# EasyEDA Pro project ProPrj_SuperCapTestBoard - 2.1_2024-07-26.epro, board PCB2
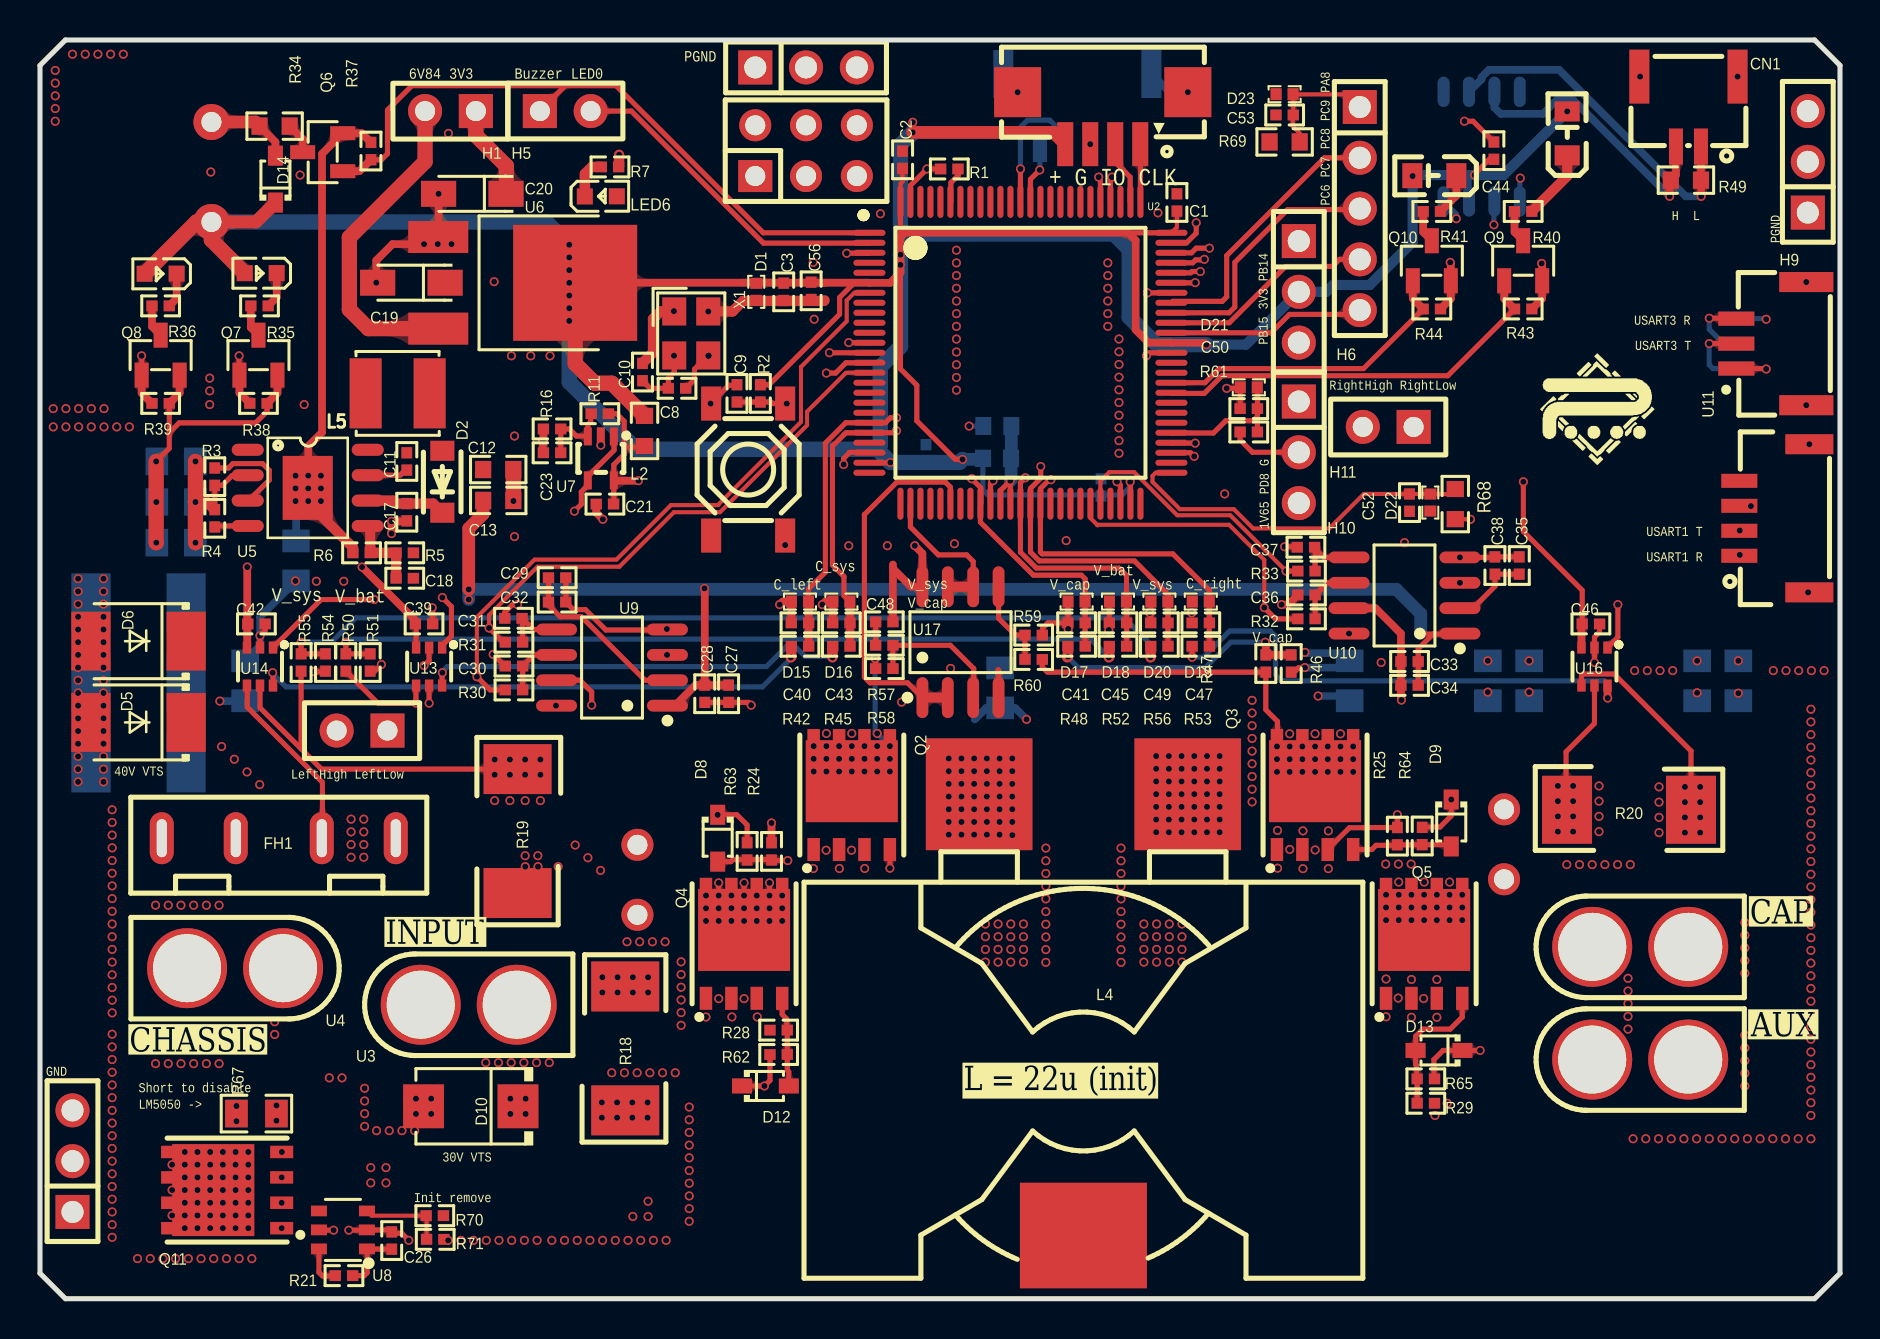
[diagram p3: board, top side]
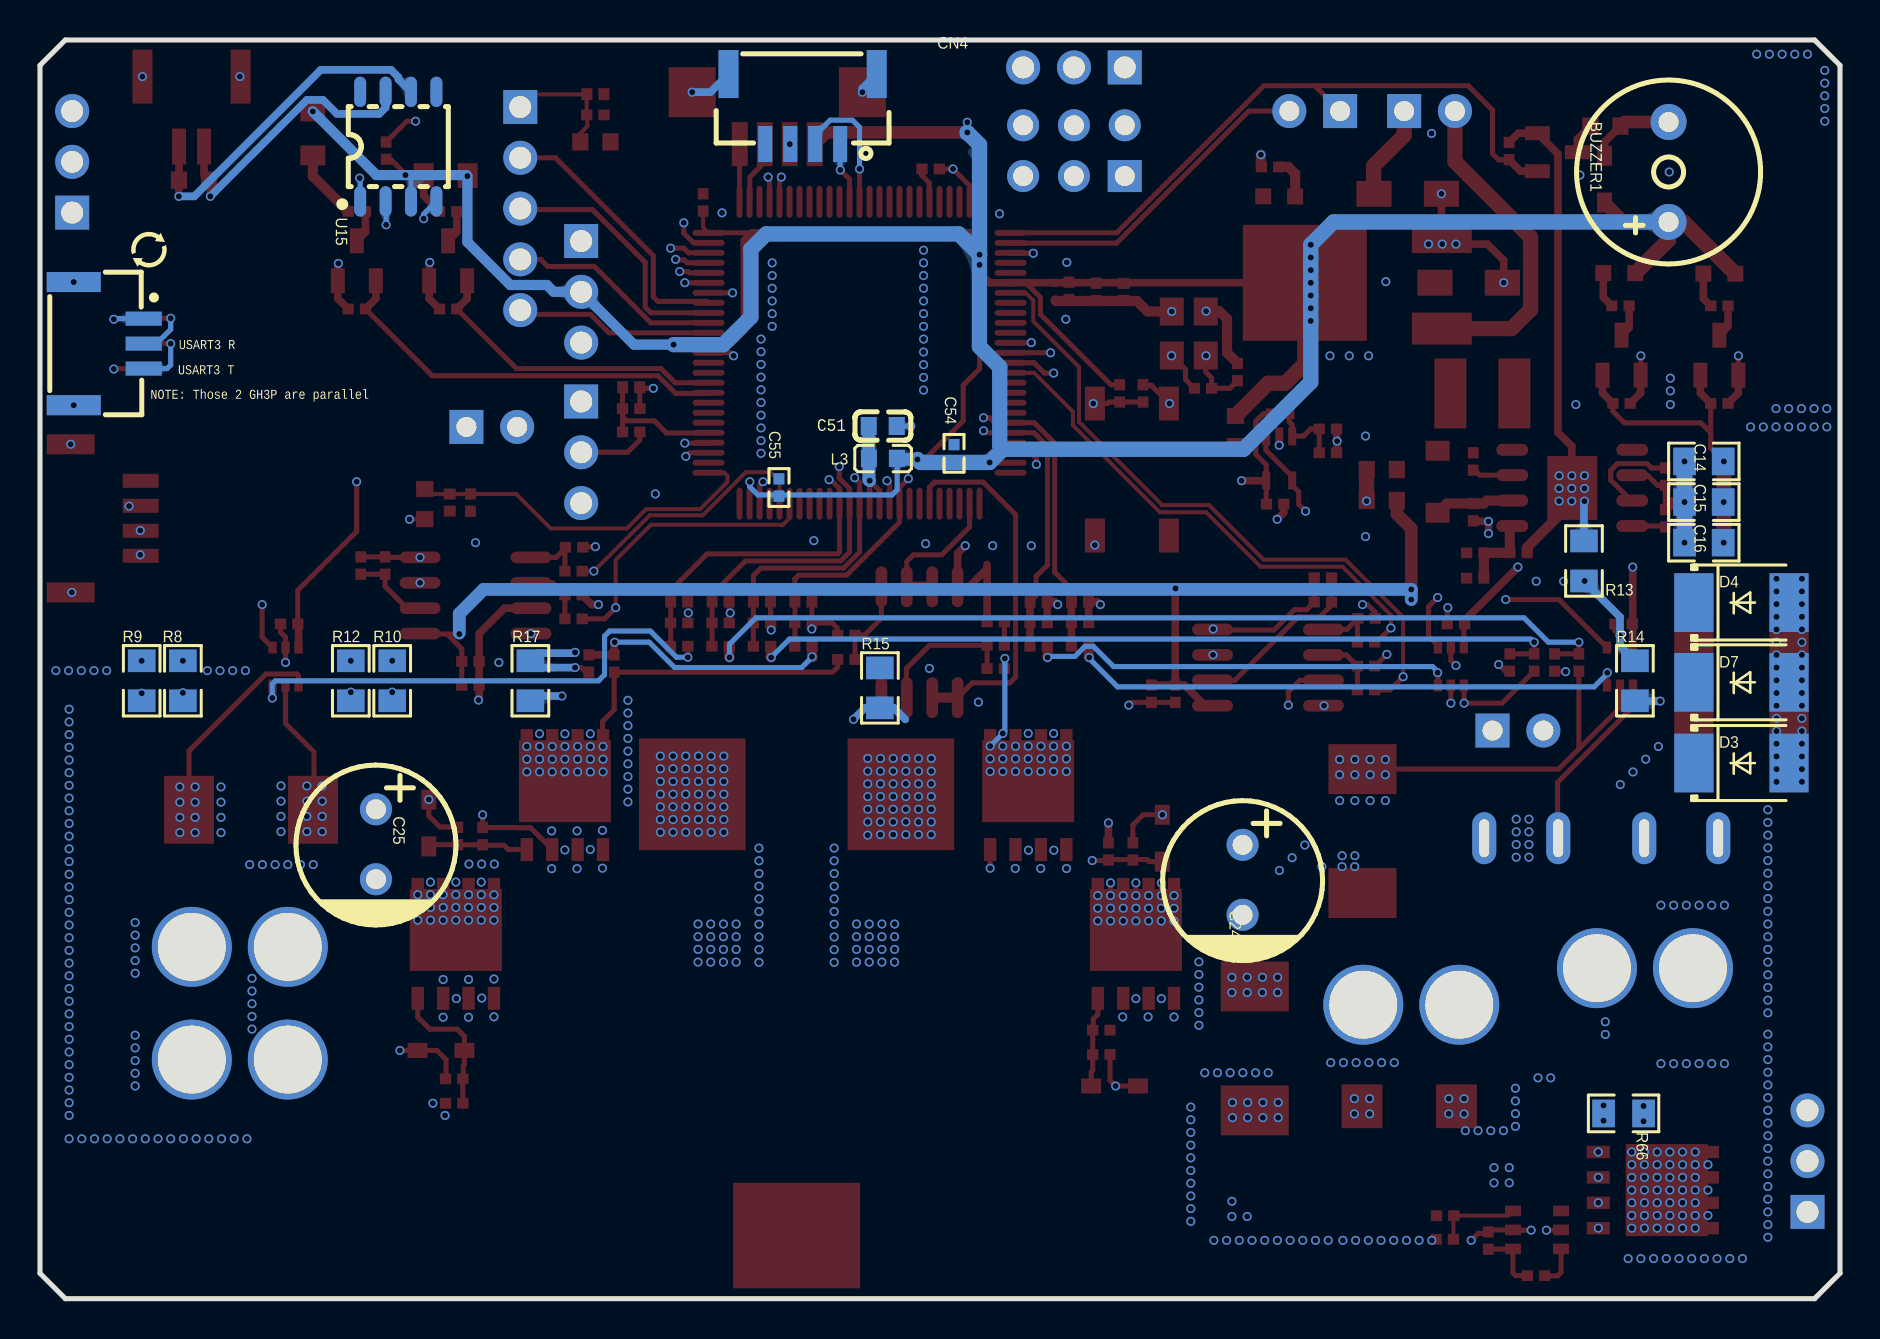
[diagram p4: board, bottom side, seen from below]

Outline 90 x 62.96 mm; copper layers: Top Layer, Inner1, Inner2, Bottom Layer. Coordinates in mm from the lower left corner of the outline.
Outline path: 0,61.69 0,1.27 1.27,0 88.73,0 90,1.27 90,61.69 88.73,62.96 1.27,62.96 0,61.69
Stack: Top Layer 0.035mm 外层铜厚1oz / Dielectric1 0.2104mm 7628 RC49% 8.6mil / Inner1 0.0152mm 内层铜厚 / Dielectric2 1.065mm 1.1mm H/HOZ 含铜 / Inner2 0.0152mm 内层铜厚 / Dielectric3 0.2104mm 7628 RC49% 8.6mil / Bottom Layer 0.035mm 外层铜厚1oz

## Design rules (mm)
template: 自定义配置
spacing copperThickness1oz (default): track to track 0.102, other pairs 0.152 to 0.3
spacing copperThickness2oz: track to track 0.203, other pairs 0.152 to 0.3
spacing copperThicknessInner0.5oz: track to track 0.089, other pairs 0.152 to 0.3
track width copperThickness1oz (default): min 0.102, default 0.254, max 155.001
track width copperThickness2oz: min 0.203, default 0.254, max 2.54
track width copperThickness0.5oz: min 0.089, default 0.254, max 2.54
differential pair differentialPair (default): width min 0.127, default 0.254, max 2.54; gap min 0.152, default 0.152
via viaSize (default): diameter min 0.3, default 0.61, max 10; hole min 0.201, default 0.305, max 6.299
pour e43426 uses copperRegion1

## Placement (name value [footprint] x y rotation side)
BUZZER1  3kHz  [BUZ-TH_BD9.0-P5.00-D0.6-FD]  8.57 56.36 90 bottom
C1  100nF  [C0402]  56.84 54.84 270 top
C2  100nF  [C0402]  43.13 56.97 270 top
C3  4.7uF  [C0402]  37.19 50.37 90 top
C8  22pF  [C0402]  31.85 45.54 0 top
C9  1uF  [C0402]  34.85 45.29 270 top
C10  22pF  [C0402]  30.12 46.35 270 top
C11  100nF  [C0402]  18.34 41.88 90 top
C12  10uF  [C0603]  22.91 41.48 180 top
C13  10uF  [C0603]  22.91 39.93 180 top
C14  1uF  [R0805_NEW]  6.81 41.88 0 bottom
C15  1uF  [R0805_NEW]  6.81 39.85 0 bottom
C16  1uF  [R0805_NEW]  6.81 37.82 0 bottom
C17  100nF  [C0402]  18.34 39.34 90 top
C18  100pF  [C0402]  18.24 36.04 0 top
C19  10uF  [CAP-SMD_L3.2-W1.6-RD-C7171]  18.57 50.82 180 top
C20  10uF  [CAP-SMD_L3.2-W1.6-RD-C7171]  21.62 55.27 180 top
C21  1uF  [C0402]  28.25 39.75 180 top
C23  1uF  [C0402]  25.6 42.31 180 top
C24  100uF  [CAP-TH_BD8.0-P3.50-D0.6-FD]  29.87 20.95 270 bottom
C25  100uF  [CAP-TH_BD8.0-P3.50-D0.6-FD]  73.2 22.73 270 bottom
C26  100nF  [C0402]  17.59 2.91 270 top
C27  10nF  [C0402]  34.43 30.26 90 top
C28  1uF  [C0402]  33.24 30.26 90 top
C29  100nF  [C0402]  25.86 36.07 180 top
C30  1nF  [C0402]  23.7 31.65 180 top
C31  1nF  [C0402]  23.67 34.03 180 top
C32  1nF  [C0402]  25.86 34.85 180 top
C33  10nF  [C0402]  68.48 31.87 0 top
C34  1uF  [C0402]  68.48 30.68 0 top
C35  100nF  [C0402]  73.97 36.68 270 top
C36  1nF  [C0402]  63.32 35.2 180 top
C37  1nF  [C0402]  63.3 37.59 180 top
C38  1nF  [C0402]  72.75 36.68 270 top
C39  100nF  [C0402]  19.2 33.75 0 top
C40  1nF  [C0402]  38 33.81 0 top
C41  1nF  [C0402]  51.83 33.81 0 top
C42  100nF  [C0402]  10.82 33.75 0 top
C43  1nF  [C0402]  40.07 33.81 0 top
C44  100nF  [C0402]  72.69 57.43 90 top
C45  1nF  [C0402]  53.9 33.81 0 top
C46  100nF  [C0402]  77.54 33.75 0 top
C47  1nF  [C0402]  58.04 33.81 0 top
C48  100nF  [C0402]  42.22 33.86 180 top
C49  1nF  [C0402]  55.97 33.81 0 top
C50  1nF  [C0402]  60.44 44.52 0 top
C51  1uF  [C0603#2]  47.86 43.66 0 bottom
C52  1nF  [C0402]  68.48 39.82 90 top
C53  1nF  [C0402]  62.23 59.21 0 top
C54  100nF  [C0402]  44.3 42.29 270 bottom
C55  100nF  [C0402]  53.05 40.58 270 bottom
C56  100nF  [C0402]  38.56 50.42 90 top
CN1  HC-GH-2PWT  [CONN-SMD_2P-P1.25_HCTL_HC-GH-2PWTKK]  82.42 59.38 180 top
CN2  SWD  [CONN-SMD_4P-P1.25-HC-1.25-4PWT]  53.14 59.05 180 top
CN3  USART1  [CONN-SMD_HC-GH-4PWT]  86.72 39.04 90 top
CN4  USART2 Rote  [CONN-SMD_HC-GH-4PWT]  51.87 59.51 0 bottom
D1  ESD9B3.3ST5G-N  [DFN1006-2L-BI]  35.81 50.37 90 top
D2  SM4007PL  [SOD-123F_L2.8-W1.8-LS3.7-RD]  20.12 40.87 90 top
D3  SMBJ40A  [SMB_L4.3-W3.6-LS5.4-R-RD]  4.93 26.79 180 bottom
D4  SMBJ40A  [SMB_L4.3-W3.6-LS5.4-R-RD]  4.93 34.82 180 bottom
D5  SMBJ40A  [SMB_L4.3-W3.6-LS5.4-R-RD]  4.93 28.83 180 top
D6  SMBJ40A  [SMB_L4.3-W3.6-LS5.4-R-RD]  4.93 32.89 180 top
D7  SMBJ40A  [SMB_L4.3-W3.6-LS5.4-R-RD]  4.93 30.83 180 bottom
D8  1N4148WS  [SOD-323_L1.8-W1.3-LS2.5-RD]  33.88 23.04 270 top
D9  1N4148WS  [SOD-323_L1.8-W1.3-LS2.5-RD]  70.56 23.8 270 top
D10  SMBJ30A  [SMB_L4.6-W3.6-LS5.3-RD]  21.54 9.62 180 top
D12  1N4148WS  [SOD-323_L1.8-W1.3-LS2.5-RD]  36.27 10.64 0 top
D13  1N4148WS  [SOD-323_L1.8-W1.3-LS2.5-RD]  69.95 12.42 180 top
D14  1N4148WS  [SOD-323_L1.8-W1.3-LS2.5-RD]  11.77 56.01 90 top
D15  ESD9B3.3ST5G-N  [DFN1006-2L-BI]  38 34.87 0 top
D16  ESD9B3.3ST5G-N  [DFN1006-2L-BI]  40.07 34.87 0 top
D17  ESD9B3.3ST5G-N  [DFN1006-2L-BI]  51.83 34.87 0 top
D18  ESD9B3.3ST5G-N  [DFN1006-2L-BI]  53.9 34.87 0 top
D19  ESD9B3.3ST5G-N  [DFN1006-2L-BI]  58.04 34.87 0 top
D20  ESD9B3.3ST5G-N  [DFN1006-2L-BI]  55.97 34.87 0 top
D21  ESD9B3.3ST5G-N  [DFN1006-2L-BI]  60.44 45.59 0 top
D22  ESD9B3.3ST5G-N  [DFN1006-2L-BI]  69.51 39.82 90 top
D23  ESD9B3.3ST5G-N  [DFN1006-2L-BI]  62.23 60.25 0 top
FH1  XF-506P  [FUSE-TH_XF-506P]  11.94 23.04 0 top
H1  AnalogVoltage  [HDR-TH_2P-P2.54-V-F]  20.52 59.41 180 top
H5  PWM test  [HDR-TH_2P-P2.54-V-F]  26.26 59.41 0 top
H6  -  [HDR-TH_5P-P2.54-V-M]  65.99 54.53 270 top
H7  Switch  [HDR-TH_3P-P2.54-V-M]  62.94 50.37 270 top
H8  -  [HDR-TH_2P-P2.54-V-F]  16.1 28.42 180 top
H9  -  [HDR-TH_3P-P2.54-V-M]  88.39 56.87 90 top
H10  ADC test  [HDR-TH_3P-P2.54-V-M]  62.94 42.34 270 top
H11  -  [HDR-TH_2P-P2.54-V-F]  67.41 43.61 180 top
H12  -  [HDR-TH_3P-P2.54-V-M]  1.63 6.88 90 top
H13  -  [HDR-TH_6P-P2.54-V-F-R2-C3-S2.54]  38.3 57.43 0 top
H14  -  [HDR-TH_3P-P2.54-V-M]  38.3 61.59 0 top
L2  GZ1608D601TF  [R0603_NEW]  30.23 43.41 270 top
L3  GZ1608D601TF  [L0603]  47.85 42.03 0 bottom
L4  22uH  [IND-SMD_3P-L27.9-W19.7-P10.43-LS27.9-BL-A]  52.17 14.2 180 top
L5  22uH  [IND-SMD_L4.0-W4.0]  17.88 45.29 0 top
LED2  RLED0  [LED0603-RD_WHITE]  11.04 51.3 180 top
LED3  YLED1  [LED0603-RD_WHITE]  6.03 51.27 180 top
LED4  LED B0  [LED0805-RD_BLUE]  76.36 58.29 90 top
LED5  LED B1  [LED0805-RD_BLUE]  69.72 56.18 180 top
LED6  KT-0603R  [LED0603-RD_WHITE]  28.04 55.14 0 top
Q2  STL130N6F7  [POWERFLAT-8_L5.2-W6.0-P1.27-LS6.2-BL]  40.59 25.19 0 top
Q3  STL130N6F7  [POWERFLAT-8_L5.2-W6.0-P1.27-LS6.2-BL]  63.75 25.19 0 top
Q4  STL130N6F7  [POWERFLAT-8_L5.2-W6.0-P1.27-LS6.2-BL]  35.2 17.75 0 top
Q5  STL130N6F7  [POWERFLAT-8_L5.2-W6.0-P1.27-LS6.2-BL]  69.21 17.75 0 top
Q6  2N7002  [SOT-23-3_L2.9-W1.3-P1.90-LS2.4-BR]  14.13 57.35 0 top
Q7  2N7002  [SOT-23-3_L2.9-W1.3-P1.90-LS2.4-BR]  10.92 47.2 270 top
Q8  2N7002  [SOT-23-3_L2.9-W1.3-P1.90-LS2.4-BR]  6.03 47.2 270 top
Q9  2N7002  [SOT-23-3_L2.9-W1.3-P1.90-LS2.4-BR]  74.16 51.92 270 top
Q10  2N7002  [SOT-23-3_L2.9-W1.3-P1.90-LS2.4-BR]  69.59 51.92 270 top
Q11  STL130N6F7  [POWERFLAT-8_L5.2-W6.0-P1.27-LS6.2-BL]  9.36 5.43 90 top
R1  10kΩ  [R0402]  45.47 56.51 0 top
R2  10kΩ  [R0402]  36.02 45.29 90 top
R3  470Ω  [R0402]  8.74 41.12 270 top
R4  1MΩ  [R0402]  8.74 39.04 90 top
R5  4.7kΩ  [R0402]  18.24 37.31 180 top
R6  1kΩ  [R0402]  16.08 37.31 0 top
R7  1kΩ  [R0402]  28.5 56.61 0 top
R8  0Ω  [R0805]  82.85 30.91 270 bottom
R9  0Ω  [R0805]  84.92 30.91 270 bottom
R10  0Ω  [R0805]  72.39 30.91 270 bottom
R11  4.7kΩ  [R0402]  27.99 44.27 180 top
R12  0Ω  [R0805]  74.46 30.91 90 bottom
R13  0Ω  [R0805]  12.8 36.9 90 bottom
R14  0Ω  [R0805]  10.25 30.91 90 bottom
R15  0Ω  [R0805]  48.01 30.55 90 bottom
R16  4.7kΩ  [R0402]  25.6 43.51 180 top
R17  0Ω  [R0805]  65.48 30.91 90 bottom
R18  5mΩ  [RES-SMD_L6.4-W3.2-1]  29.26 12.52 270 top
R19  5mΩ  [RES-SMD_L6.4-W3.2-1]  23.88 23.39 90 top
R20  5mΩ  [RES-SMD_L6.4-W3.2-1]  79.45 24.46 180 top
R21  100Ω  [R0402]  15.2 1.15 180 top
R24  10kΩ  [R0402]  36.58 22.38 270 top
R25  10kΩ  [R0402]  67.87 23.14 270 top
R28  10kΩ  [R0402]  36.93 13.43 0 top
R29  10kΩ  [R0402]  69.29 9.78 180 top
R30  100Ω  [R0402]  23.7 30.45 0 top
R31  100Ω  [R0402]  23.7 32.84 0 top
R32  100Ω  [R0402]  63.32 34.01 0 top
R33  100Ω  [R0402]  63.32 36.4 0 top
R34  330Ω  [R0603]  11.73 58.66 180 top
R35  1kΩ  [R0402]  10.97 49.66 0 top
R36  1kΩ  [R0402]  6.03 49.66 0 top
R37  10kΩ  [R0402]  16.55 57.41 270 top
R38  10kΩ  [R0402]  10.92 44.79 180 top
R39  10kΩ  [R0402]  6.03 44.79 180 top
R40  200Ω  [R0402]  74.16 54.39 0 top
R41  200Ω  [R0402]  69.59 54.39 0 top
R42  33Ω  [R0402]  38 32.64 0 top
R43  10kΩ  [R0402]  74.16 49.51 180 top
R44  10kΩ  [R0402]  69.59 49.51 180 top
R45  33Ω  [R0402]  40.07 32.64 0 top
R46  1kΩ  [R0402]  62.56 31.77 90 top
R47  10kΩ  [R0402]  61.29 31.77 270 top
R48  33Ω  [R0402]  51.83 32.64 0 top
R49  120Ω  [R0603]  82.3 55.95 180 top
R50  10kΩ  [R0402]  15.29 31.82 270 top
R51  1kΩ  [R0402]  16.51 31.82 90 top
R52  33Ω  [R0402]  53.9 32.64 0 top
R53  33Ω  [R0402]  58.04 32.64 0 top
R54  1kΩ  [R0402]  14.28 31.82 90 top
R55  10kΩ  [R0402]  13.06 31.82 270 top
R56  33Ω  [R0402]  55.97 32.64 0 top
R57  1kΩ  [R0402]  42.22 32.69 0 top
R58  10kΩ  [R0402]  42.22 31.52 180 top
R59  1kΩ  [R0402]  49.68 33.2 180 top
R60  10kΩ  [R0402]  49.68 31.98 0 top
R61  33Ω  [R0402]  60.44 43.36 0 top
R62  2Ω  [R0402]  36.93 12.22 0 top
R63  2Ω  [R0402]  35.36 22.38 270 top
R64  2Ω  [R0402]  69.11 23.14 90 top
R65  2Ω  [R0402]  69.29 11 0 top
R66  0Ω  [R0805]  10.82 9.27 0 bottom
R67  0Ω  [R0805]  10.82 9.26 0 top
R68  0Ω  [R0603]  70.76 39.75 90 top
R69  0Ω  [R0603]  62.23 57.87 0 top
R70  100kΩ  [R0402]  19.74 4.15 180 top
R71  100kΩ  [R0402]  19.76 2.97 180 top
SW1  Reset  [SW-SMD_4P-L5.1-W5.1-P3.70-LS6.5-TL-2]  35.41 41.48 270 top
U1  Capacitor  [CONN-TH_XT30U-F]  80.01 11.96 180 top
U2  STM32G473VET6  [LQFP-100_L14.0-W14.0-P0.50-LS16.0-BL]  49.02 47.32 270 top
U3  P_input  [CONN-TH_XT30U-F]  21.44 14.7 180 top
U4  Chassis  [CONN-TH_XT30U-F]  9.75 16.53 0 top
U5  SY8501FCC  [SO-8_L4.9-W3.9-P1.27-LS6.0-BL-EP]  13.39 40.56 270 top
U6  LM1117DTX-3.3/NOPB  [TO-252-2_L6.6-W6.1-P4.57-LS9.9-BR-CW]  23.33 50.82 180 top
U7  TLV521DCKR  [SC-70-5_L2.1-W1.3-P0.65-LS2.1-BR]  28.04 42.03 90 top
U8  LM5050MK-1/NOPB  [TSOT-23-6_L2.9-W1.6-P0.95-LS2.8-BR]  15.15 3.44 0 top
U9  UCC27284QDRQ1  [SOIC-8_L4.9-W3.9-P1.27-LS6.0-BL]  28.6 31.57 90 top
U10  UCC27284QDRQ1  [SOIC-8_L4.9-W3.9-P1.27-LS6.0-BL]  68.22 35.18 90 top
U11  USART3  [CONN-SMD_GH-3PWT]  86.57 47.78 90 top
U12  USART3 Rote  [CONN-SMD_GH-3PWT]  86.56 47.78 270 bottom
U13  C_sys  [SC-70-6_L2.2-W1.3-P0.65-LS2.1-BR]  19.46 31.62 90 top
U14  C_left  [SC-70-6_L2.2-W1.3-P0.65-LS2.1-BR]  11 31.62 90 top
U15  SN65HVD232D  [SOIC-8_L4.9-W3.9-P1.27-LS6.0-TL]  72.09 57.63 90 bottom
U16  C_right  [SC-70-6_L2.2-W1.3-P0.65-LS2.1-BR]  77.72 31.62 90 top
U17  OPAMPtest  [SOIC-8_L4.9-W3.9-P1.27-LS6.0-BL]  46.03 32.84 0 top
U18  Chassis_P  [CONN-TH_XT30U-F]  80.01 17.6 180 top
X1  48MHz  [CRYSTAL-SMD_4P-L3.2-W2.5-BL]  32.56 48.28 270 top

## Footprints (pads in the part's own frame, mm; a bottom-side part is the same pattern mirrored in y, then rotated)
BUZ-TH_BD9.0-P5.00-D0.6-FD
  round 1.8 hole 1: 1(-2.5,0) 2(2.5,0)
C0402
  rect 0.566x0.54 smd: 1(-0.433,0) 2(0.433,0)
C0603
  rect 0.806x0.864 smd: 1(-0.753,0) 2(0.753,0)
C0603#2
  rect 0.8x0.9 smd: 1(-0.7,0) 2(0.7,0)
CAP-SMD_L3.2-W1.6-RD-C7171
  rect 1.758x1.296 smd: 1(-1.687,0) 2(1.687,0)
CAP-TH_BD8.0-P3.50-D0.6-FD
  round 1.6 hole 1: 1(-1.75,0) 2(1.75,0)
CONN-SMD_2P-P1.25_HCTL_HC-GH-2PWTKK
  rect 0.7x1.8 smd: 1(-0.625,1.75) 2(0.625,1.75)
  rect 1x2.7 smd: 3(2.455,-1.75) 4(-2.455,-1.75)
CONN-SMD_4P-P1.25-HC-1.25-4PWT
  rect 0.8x2.2 smd: 1(-1.875,1.3) 2(-0.625,1.3) 3(0.625,1.3) 4(1.875,1.3)
  rect 2.35x2.5 smd: 5(4.255,-1.3) 6(-4.255,-1.3)
CONN-SMD_GH-3PWT
  rect 0.7x1.8 smd: 1(-1.25,1.75) 2(0,1.75) 3(1.25,1.75)
  rect 1x2.7 smd: 4(-3.08,-1.75) 5(3.08,-1.75)
CONN-SMD_HC-GH-4PWT
  rect 0.7x1.8 smd: 1(-1.875,1.75) 2(-0.625,1.75) 3(0.625,1.75) 4(1.875,1.75)
  rect 1x2.4 smd: 5(3.705,-1.75) 6(-3.705,-1.75)
CONN-TH_XT30U-F
  round 4 hole 3.4: 1(2.4,0) 2(-2.4,0)
CRYSTAL-SMD_4P-L3.2-W2.5-BL
  rect 1.4x1.2 smd: 1(-1.1,-0.85) 2(1.1,-0.85) 3(1.1,0.85) 4(-1.1,0.85)
DFN1006-2L-BI
  rect 0.55x0.6 smd: 1(-0.425,0) 2(0.425,0)
FUSE-TH_XF-506P
  oval 1.2x2.6 hole 0.5x1.9: 1(-5.85,0) 1(-2.15,0) 2(2.15,0) 2(5.85,0)
HDR-TH_2P-P2.54-V-F
  rect 1.7x1.7 hole 1: 1(-1.27,0)
  round 1.7 hole 1: 2(1.27,0)
HDR-TH_3P-P2.54-V-M
  rect 1.7x1.7 hole 1.1: 1(-2.54,0)
  round 1.7 hole 1.1: 2(0,0) 3(2.54,0)
HDR-TH_5P-P2.54-V-M
  rect 1.7x1.7 hole 1.1: 1(-5.08,0)
  round 1.7 hole 1.1: 2(-2.54,0) 3(0,0) 4(2.54,0) 5(5.08,0)
HDR-TH_6P-P2.54-V-F-R2-C3-S2.54
  rect 1.7x1.6 hole 1: 1(-2.54,-1.27)
  round 1.6 hole 1: 2(-2.54,1.27) 3(0,-1.27) 4(0,1.27) 5(2.54,-1.27) 6(2.54,1.27)
IND-SMD_3P-L27.9-W19.7-P10.43-LS27.9-BL-A
  rect 5.33x5.59 smd: 1(-5.215,-11.037) 2(5.215,-11.037)
  rect 6.35x5.28 smd: 3(0,11.037)
IND-SMD_L4.0-W4.0
  rect 1.6x3.5 smd: 1(-1.6,0) 2(1.6,0)
L0603
  rect 0.8x0.864 smd: 1(-0.7,0) 2(0.7,0)
LED0603-RD_WHITE
  rect 0.8x0.8 smd: 1(-0.799,-0.004) 2(0.799,0.004)
LED0805-RD_BLUE
  rect 1x1.25 smd: 1(-1.1,0) 2(1.1,0)
LQFP-100_L14.0-W14.0-P0.50-LS16.0-BL
  oval 0.3x1.6 smd: 1(-6,-7.55) 2(-5.5,-7.55) 3(-5,-7.55) 4(-4.5,-7.55) 5(-4,-7.55) 6(-3.5,-7.55) 7(-3,-7.55) 8(-2.5,-7.55) 9(-2,-7.55) 10(-1.5,-7.55) 11(-1,-7.55) 12(-0.5,-7.55) 13(0,-7.55) 14(0.5,-7.55) 15(1,-7.55) 16(1.5,-7.55) 17(2,-7.55) 18(2.5,-7.55) 19(3,-7.55) 20(3.5,-7.55) 21(4,-7.55) 22(4.5,-7.55) 23(5,-7.55) 24(5.5,-7.55) 25(6,-7.55) 51(6,7.55) 52(5.5,7.55) 53(5,7.55) 54(4.5,7.55) 55(4,7.55) 56(3.5,7.55) 57(3,7.55) 58(2.5,7.55) 59(2,7.55) 60(1.5,7.55) 61(1,7.55) 62(0.5,7.55) 63(0,7.55) 64(-0.5,7.55) 65(-1,7.55) 66(-1.5,7.55) 67(-2,7.55) 68(-2.5,7.55) 69(-3,7.55) 70(-3.5,7.55) 71(-4,7.55) 72(-4.5,7.55) 73(-5,7.55) 74(-5.5,7.55) 75(-6,7.55)
  oval 1.6x0.3 smd: 26(7.55,-6) 27(7.55,-5.5) 28(7.55,-5) 29(7.55,-4.5) 30(7.55,-4) 31(7.55,-3.5) 32(7.55,-3) 33(7.55,-2.5) 34(7.55,-2) 35(7.55,-1.5) 36(7.55,-1) 37(7.55,-0.5) 38(7.55,0) 39(7.55,0.5) 40(7.55,1) 41(7.55,1.5) 42(7.55,2) 43(7.55,2.5) 44(7.55,3) 45(7.55,3.5) 46(7.55,4) 47(7.55,4.5) 48(7.55,5) 49(7.55,5.5) 50(7.55,6) 76(-7.55,6) 77(-7.55,5.5) 78(-7.55,5) 79(-7.55,4.5) 80(-7.55,4) 81(-7.55,3.5) 82(-7.55,3) 83(-7.55,2.5) 84(-7.55,2) 85(-7.55,1.5) 86(-7.55,1) 87(-7.55,0.5) 88(-7.55,0) 89(-7.55,-0.5) 90(-7.55,-1) 91(-7.55,-1.5) 92(-7.55,-2) 93(-7.55,-2.5) 94(-7.55,-3) 95(-7.55,-3.5) 96(-7.55,-4) 97(-7.55,-4.5) 98(-7.55,-5) 99(-7.55,-5.5) 100(-7.55,-6)
POWERFLAT-8_L5.2-W6.0-P1.27-LS6.2-BL
  rect 0.62x1.15 smd: 1(-1.905,-2.727) 2(-0.635,-2.727) 3(0.635,-2.727) 4(1.905,-2.727) 5(1.905,2.727) 6(0.635,2.727) 7(-0.635,2.727) 8(-1.905,2.727)
  rect 4.6x4.1 smd: 8(0,0.694)
R0402
  rect 0.566x0.54 smd: 1(-0.433,0) 2(0.433,0)
R0603
  rect 0.806x0.864 smd: 1(-0.753,0) 2(0.753,0)
R0603_NEW
  rect 0.806x0.864 smd: 1(-0.753,0) 2(0.753,0)
R0805
  rect 1.133x1.377 smd: 1(-1,0) 2(1,0)
R0805_NEW
  rect 1.133x1.377 smd: 1(-0.966,0) 2(0.966,0)
RES-SMD_L6.4-W3.2-1
  rect 2.5x3.4 smd: 1(-3.1,0) 2(3.1,0)
SC-70-5_L2.1-W1.3-P0.65-LS2.1-BR
  rect 0.9x0.4 smd: 1(1.1,-0.65) 2(1.1,0) 3(1.1,0.65) 4(-1.1,0.65) 5(-1.1,-0.65)
SC-70-6_L2.2-W1.3-P0.65-LS2.1-BR
  rect 0.6x0.42 smd: 1(0.95,-0.65) 2(0.95,0) 3(0.95,0.65) 4(-0.95,0.65) 5(-0.95,0) 6(-0.95,-0.65)
SMB_L4.3-W3.6-LS5.4-R-RD
  rect 1.96x2.94 smd: 1(2.38,0) 2(-2.38,0)
SMB_L4.6-W3.6-LS5.3-RD
  rect 2.047x2.192 smd: 1(-2.361,0) 2(2.361,0)
SO-8_L4.9-W3.9-P1.27-LS6.0-BL-EP
  oval 0.6x1.6 smd: 1(-1.905,-3) 2(-0.635,-3) 3(0.635,-3) 4(1.905,-3) 5(1.905,3) 6(0.635,3) 7(-0.635,3) 8(-1.905,3)
  rect 3.2x2.5 smd: 9(0,0)
SOD-123F_L2.8-W1.8-LS3.7-RD
  rect 1x1.2 smd: 1(-1.55,0) 2(1.55,0)
SOD-323_L1.8-W1.3-LS2.5-RD
  rect 1x0.75 smd: 1(-1.173,0) 2(1.173,0)
SOIC-8_L4.9-W3.9-P1.27-LS6.0-BL
  oval 0.588x2.045 smd: 1(-1.905,-2.772) 2(-0.635,-2.772) 3(0.635,-2.772) 4(1.905,-2.772) 5(1.905,2.772) 6(0.635,2.772) 7(-0.635,2.772) 8(-1.905,2.772)
SOIC-8_L4.9-W3.9-P1.27-LS6.0-TL
  oval 1.52x0.6 smd: 1(-2.74,1.905) 2(-2.74,0.635) 3(-2.74,-0.635) 4(-2.74,-1.905) 5(2.74,-1.905) 6(2.74,-0.635) 7(2.74,0.635) 8(2.74,1.905)
SOT-23-3_L2.9-W1.3-P1.90-LS2.4-BR
  rect 1.25x0.7 smd: 1(1,-0.95) 2(1,0.95) 3(-1,0)
SW-SMD_4P-L5.1-W5.1-P3.70-LS6.5-TL-2
  rect 1.7x1 smd: 1(-3.3,1.85) 2(3.3,1.85) 3(-3.3,-1.85) 4(3.3,-1.85)
TO-252-2_L6.6-W6.1-P4.57-LS9.9-BR-CW
  rect 3x1.6 smd: 1(3.424,-2.29) 3(3.424,2.29)
  rect 6.2x5.8 smd: 2(-3.424,0)
TSOT-23-6_L2.9-W1.6-P0.95-LS2.8-BR
  rect 0.8x0.532 smd: 1(1.2,-0.95) 2(1.2,0) 3(1.2,0.95) 4(-1.2,0.95) 5(-1.2,0) 6(-1.2,-0.95)

## Nets
As in the schematic, except:
AUXVOLTAGEINPUT: C14.2 C15.2 C16.2 D3.2 D4.2 D5.2 D6.2 D7.2 FH1.1 Q11.5 Q11.6 Q11.7 Q11.8 R3.2 R4.2 R66.1 R67.1 U4.2 U5.2

Pads without a net: CN3 4; CN4 4; L4 3; U2 4 5 8 9 10 11 16 17 18 19 22 25 26 28 29 30 32 33 41 42 43 44 47 50 52 56 57 58 61 62 78 81 82 83 84 85 86 89 90 91 92 93 94 96 97 98; U5 1; U15 5 8

## Via types
v1: diameter 0.45, hole 0.305, Top Layer to Bottom Layer, 912 vias

## Routing (per net, layer and track width the routed paths; a pad name or vN(x,y) marks a point on that pad's centre or on a via; arc(x,y) is an arc through that point)
1V65: length 16.6
  Top Layer w0.203: 70.76,39 71.52,39 v1(71.53,38.99)
  Top Layer w0.254: U13.1 20.11,32.68 20.57,33.14 20.57,34.62 v1(20.12,35.08) ; v1(16.71,34.97) 14.05,34.97 U14.1 ; v1(78.89,34.72) 78.89,33.09 U16.1 ; v1(26.72,39.39) 27.06,39.74 27.06,40.36 27.39,40.68 U7.4 27.39,41.13 28.7,42.44 28.7,43.12 U7.1
3V3: length 222.5
  Top Layer w0.203: 43.13,56.38 43.13,55.88 43.02,55.77 U2.100 ; U2.75 56.84,53.59 C1.2
  Top Layer w0.254: 43.02,51.33 43.02,46.51 43.84,45.69 43.84,43.91 45.77,41.98 v1(46.13,41.98) ; v1(54.51,40.87) 54.52,40.85 U2.49 ; U2.24 42.51,41.82 v1(42.52,41.83) ; D1.2 38.2,50.79 ; 43.02,53.1 U2.100 ; 38.09,50.81 39.23,50.81 ; U2.75 54.4,53.32 ; C44.1 72.47,56.99 71.73,56.26 v1(71.73,56.21) ; R2.2 36.46,45.72 39.98,49.24 39.98,50.09 40.57,50.67 40.58,50.67
  Top Layer w0.381: 39.25,50.82 26.77,50.82 U6.2 ; 39.25,50.82 41.47,50.82 U2.6 42.51,50.82 43.02,51.33 v1(43.02,51.72) v1(43.02,52.22) 43.02,53.1 43.24,53.32 54.4,53.32 54.78,52.94 54.78,48.47 55.42,47.83 56.56,47.83 U2.64 58.22,47.82 v1(58.32,47.72) ; 39.25,50.82 39.23,50.81
  Top Layer w0.635: D14.1 10.8,53.86 BUZZER1.1 ; CN2.4 50.67,58.34 v1(43.64,58.34)
  Top Layer w0.762: H1.1 21.79,58.19 23.32,56.67 23.32,55.28 C20.1 ; LED2.2 8.57,52.96 BUZZER1.1 7.82,53.86 LED3.2 ; U6.2 26.76,46.77 27.74,45.79 28.59,45.79 L2.1
  Bottom Layer w0.254: v1(54.51,40.87) 54.51,40.61 54.1,40.21 47.4,40.21 47.14,40.46 47.14,42.02 ; 71.48,56.11 71.45,56.08 U15.3
  Bottom Layer w0.508: v1(76.36,59.39) 73.18,56.21 v1(71.73,56.21) 68.68,56.21 v1(68.63,56.16) 68.63,52.86 66.48,50.71 64.65,50.71 64.31,50.37 H7.2 60.3,47.72 v1(58.32,47.72)
  Bottom Layer w0.635: L3.1 47.14,42.02 47.1,41.98 v1(46.13,41.98)
  Bottom Layer w0.762: 43.64,58.29 v1(43.64,58.34) 43.02,57.73 v1(43.02,52.22) ; 41.86,42.54 42.02,42.7 42.02,46.61 43.03,47.62 43.03,52.22 v1(43.02,52.22) ; v1(43.02,52.22) 44.06,53.26 53.7,53.26 54.46,52.5 54.46,49.1 55.83,47.72 v1(58.32,47.72) ; BUZZER1.1 25.32,53.86 v1(26.46,52.72) v1(26.46,52.09) v1(26.46,51.45) v1(26.46,50.82) v1(26.46,50.18) v1(26.46,49.55) v1(26.46,48.91) 26.46,45.85 29.82,42.49 41.86,42.49 v1(42.52,41.83) 45.97,41.83 v1(46.13,41.98)
  vias: v1(43.64,58.85)
6V84: length 83.8
  Top Layer w0.254: 69.65,33.25 70.97,33.25 U10.1 ; 69.65,33.25 v1(69.04,33.25) ; 69.65,33.25 68.91,32.51 C33.2 C34.2
  Top Layer w0.381: v1(33.22,35.53) 33.24,35.52 C28.2 ; C28.2 C27.2 ; C28.2 32.78,30.69 31.75,29.66 31.37,29.66
  Top Layer w0.635: v1(21.44,35.48) 21.44,38.53 22.15,39.24 22.15,39.92 C13.2
  Top Layer w0.762: U6.3 16.42,48.53 15.47,49.48 15.47,53.09 19.25,56.87 H1.2
  Bottom Layer w0.635: 69.04,33.3 69.04,34.26 67.82,35.48 v1(21.44,35.48) v1(21.44,34.97)
24V: length 30
  Top Layer w0.254: 15.29,31.39 16.89,29.79 v1(18.8,29.79) 18.8,30.66 U13.4
  Inner2 w0.381: v1(18.8,29.79) 18.8,25.05 26.59,17.25 26.59,10.72 25.88,10.01 v1(24.28,10.01)
  vias: v1(22.29,11.81) v1(22.92,11.81) v1(23.52,10.01) v1(23.52,9.24) v1(23.56,11.81) v1(24.19,11.81) v1(24.28,9.24) v1(24.83,11.81) v1(25.46,11.81) v1(28.12,16.08) v1(28.12,15.32) v1(28.88,16.08) v1(28.88,15.32) v1(29.64,16.08) v1(29.64,15.32) v1(30.4,16.08) v1(30.4,15.32)
GND: length 66.1
  Top Layer w0.254: U9.7 27,30.93 27.58,30.35 v1(27.58,29.69) ; v1(18.44,2.92) 18.09,3.27 17.66,3.27 C26.1 17.49,3.44 U8.2 ; v1(15.44,3.43) 16.31,3.43 ; v1(35.56,29.69) 35.42,29.83 C27.1 C28.1 ; v1(5.81,41.88) 6.47,42.54 6.47,43.32 ; 6.47,43.32 6.96,43.81 10.78,43.81 11.36,44.39 R38.1 ; 6.47,43.32 R39.1
  Top Layer w0.381: U10.7 66.78,34.54 68.05,33.27 C33.1 C34.1 68.05,29.97 v1(68.07,29.94) ; R39.1 6.98,45.3 Q8.2 ; R38.1 11.87,45.3 Q7.2 ; v1(17.58,38.28) v1(17.58,38.89) 18.31,38.89 C17.1 ; U5.9 13.41,40.58 v1(13.41,41.17) 13.41,42.64 14.1,43.34 14.1,57.27 Q6.2 16.09,58.3 16.55,57.84
  Top Layer w0.508: 15.65,37.31 15.65,37.58 13.41,39.82 13.41,40.53 U5.9
  Top Layer w0.762: v1(5.81,37.82) 5.81,37.83 v1(5.81,41.88) ; C12.1 23.67,41.47 v1(23.67,39.9)
  Bottom Layer w0.381: v1(8.99,29.89) 10.24,29.89 R14.1 ; R17.1 65.24,30.15 v1(63.91,30.15) ; R13.2 12.8,39.87 v1(12.78,39.9) ; 46.74,28.98 47.31,29.55 R15.1 48.75,29.55 v1(49.33,28.98)
  vias: v1(0.66,43.61) v1(1.3,43.61) v1(1.93,43.61) v1(1.91,36.01) v1(1.91,35.38) v1(1.91,34.74) v1(1.91,34.11) v1(1.91,33.47) v1(1.91,32.84) v1(1.91,32.2) v1(1.91,31.57) v1(1.91,30.93) v1(1.91,30.3) v1(1.91,29.66) v1(1.91,29.03) v1(1.91,28.39) v1(1.91,27.76) v1(1.91,27.12) v1(1.91,26.49) v1(1.91,25.85) v1(2.57,43.61) v1(3.2,43.61) v1(3.17,36.01) v1(3.17,35.38) v1(3.17,34.74) v1(3.17,34.11) v1(3.17,33.47) v1(3.17,32.84) v1(3.17,32.2) v1(3.17,31.57) v1(3.17,30.93) v1(3.17,30.3) v1(3.17,29.66) v1(3.17,29.03) v1(3.17,28.39) v1(3.17,27.76) v1(3.17,27.12) v1(3.17,26.49) v1(3.17,25.85) v1(3.61,24.46) v1(3.61,23.82) v1(3.61,23.19) v1(3.61,22.55) v1(3.61,21.92) v1(3.61,21.28) v1(3.61,20.65) v1(3.61,20.01) v1(3.61,19.38) v1(3.61,18.74) v1(3.61,18.11) v1(3.61,17.47) v1(3.61,16.84) v1(3.61,16.2) v1(3.61,15.57) v1(3.61,14.93) v1(3.61,14.3) v1(3.61,13.23) v1(3.61,12.6) v1(3.61,11.96) v1(3.61,11.33) v1(3.61,10.69) v1(3.61,10.06) v1(3.61,9.42) v1(3.61,8.79) v1(3.61,8.15) v1(3.61,7.52) v1(3.61,6.88) v1(3.61,6.25) v1(3.61,5.61) v1(3.61,4.98) v1(3.61,4.34) v1(3.61,3.71) v1(3.61,3.07) v1(3.84,43.61) v1(4.47,43.61) v1(4.88,2) v1(5.51,2) v1(5.81,39.85) v1(6.15,2) v1(6.78,2) v1(7.42,2) v1(8.05,2) v1(8.69,2) v1(9.08,27.62) v1(9.32,2) v1(9.72,26.99) v1(9.96,2) v1(10.35,26.35) v1(10.59,2) v1(10.99,25.72) v1(11.73,13.85) v1(11.73,13.22) v1(12.78,41.17) v1(12.78,40.53) v1(13.41,40.53) v1(13.41,39.9) v1(14.05,41.17) v1(14.05,40.53) v1(14.05,39.9) v1(14.47,11.05) v1(15.1,11.05) v1(16.23,10.53) v1(16.23,9.89) v1(16.23,9.26) v1(16.23,8.62) v1(16.83,8.41) v1(17.46,8.41) v1(18.1,8.41) v1(18.73,8.41) v1(18.8,10.01) v1(18.8,9.24) v1(19.56,10.01) v1(19.56,9.24) v1(20.41,2.92) v1(21.04,2.92) v1(21.68,2.92) v1(22.31,2.92) v1(22.95,2.92) v1(23.58,2.92) v1(23.72,43.15) v1(23.72,38.12) v1(24.22,2.92) v1(24.85,2.92) v1(25.59,2.92) v1(26.23,2.92) v1(26.76,22.69) v1(26.86,2.92) v1(27.39,22.06) v1(27.5,2.92) v1(28.03,21.42) v1(28.13,2.92) v1(28.59,11.3) v1(28.77,2.92) v1(29.22,11.3) v1(29.35,17.85) v1(29.4,2.92) v1(29.86,11.3) v1(29.98,17.85) v1(30.04,2.92) v1(30.49,11.3) v1(30.62,17.85) v1(30.67,2.92) v1(31.13,11.3) v1(31.25,17.85) v1(31.31,2.92) v1(31.76,11.3) v1(32.06,16.85) v1(32.06,16.22) v1(32.06,15.58) v1(32.06,14.95) v1(32.06,14.31) v1(32.06,13.68) v1(32.46,9.59) v1(32.46,8.95) v1(32.46,8.32) v1(32.46,7.68) v1(32.46,7.05) v1(32.46,6.41) v1(32.46,5.78) v1(32.46,5.14) v1(32.46,4.51) v1(32.46,3.87) v1(33.3,14.09) v1(33.93,15.01) v1(34.59,14.09) v1(35.2,15.01) v1(35.87,14.09) v1(43.08,29.84) v1(50.29,22.54) v1(50.29,21.91) v1(50.29,21.27) v1(50.29,20.64) v1(50.29,20) v1(50.29,19.37) v1(50.29,18.73) v1(50.29,18.1) v1(50.29,17.46) v1(50.29,16.83) v1(54.05,22.54) v1(54.05,21.91) v1(54.05,21.27) v1(54.05,20.64) v1(54.05,20) v1(54.05,19.37) v1(54.05,18.73) v1(54.05,18.1) v1(54.05,17.46) v1(54.05,16.83) v1(60.6,29.93) v1(60.6,29.3) v1(60.6,28.66) v1(60.6,28.03) v1(60.6,27.39) v1(60.6,26.76) v1(60.6,26.12) v1(60.6,25.49) v1(60.6,24.85) v1(67.28,21.74) v1(67.3,15.99) v1(67.3,14.1) v1(67.92,21.74) v1(67.91,15.04) v1(68.55,21.74) v1(68.57,15.97) v1(68.57,14.08) v1(69.18,15.01) v1(69.75,9.17) v1(69.84,15.97) v1(69.84,14.08) v1(70.36,9.78) v1(72.39,30.34) v1(74.46,30.34) v1(76.34,21.71) v1(76.97,21.71) v1(77.61,21.71) v1(78.24,21.71) v1(78.88,21.71) v1(79.4,16.03) v1(79.4,15.39) v1(79.4,14.76) v1(79.4,14.12) v1(79.4,13.49) v1(79.51,21.71) v1(79.65,8) v1(80.29,8) v1(80.92,8) v1(81.56,8) v1(82.19,8) v1(82.83,8) v1(82.85,30.31) v1(83.46,8) v1(84.1,8) v1(84.73,8) v1(84.92,30.29) v1(85.37,8) v1(86,8) v1(86.64,8) v1(87.27,8) v1(87.91,8) v1(88.54,29.49) v1(88.54,28.85) v1(88.54,28.22) v1(88.54,27.58) v1(88.54,26.95) v1(88.54,26.31) v1(88.54,25.68) v1(88.54,25.04) v1(88.54,24.41) v1(88.54,23.77) v1(88.54,23.14) v1(88.54,22.5) v1(88.54,21.87) v1(88.54,21.23) v1(88.54,20.6) v1(88.54,19.96) v1(88.54,19.33) v1(88.54,18.69) v1(88.54,18.06) v1(88.54,17.42) v1(88.54,16.79) v1(88.54,16.15) v1(88.54,15.52) v1(88.54,14.88) v1(88.54,14.25) v1(88.54,13.61) v1(88.54,12.98) v1(88.54,12.34) v1(88.54,11.71) v1(88.54,11.07) v1(88.54,10.44) v1(88.54,9.8) v1(88.54,9.17) v1(88.54,8)
PGND: length 79.2
  Top Layer w0.254: U17.4 47.93,31.44 47.9,31.47 ; v1(86.31,46.51) 86.29,46.53 U11.1 ; v1(23.88,34.72) 23.62,34.72 23.24,34.34 C31.2 ; U2.48 54.02,40.69 v1(53.85,40.87) ; U2.74 57.33,52.82 57.81,53.3 v1(57.81,53.82) ; C9.1 34.82,45.69 34.44,45.69 v1(33.53,44.78) ; U14.2 v1(11,33.16) 11.25,33.42 11.25,33.75 ; 16.51,31.39 16.74,31.39 v1(17.07,31.72) ; v1(40.18,41.73) 40.18,42.03 40.49,42.34 41.45,42.34 U2.23 ; D17.1 51.4,33.81 C41.1 50.39,33.81 50.14,33.55 50.14,33.22 R59.1 ; R57.1 C48.2 ; v1(47.65,40.92) 47.52,40.79 U2.35 ; v1(22.66,32.23) 23.24,31.65 23.27,31.65 ; U13.2 19.46,31.93 v1(19.2,31.67) ; v1(63.25,31.57) 62.94,31.57 62.71,31.34 R46.1 ; v1(19.61,34.57) 19.64,34.54 C39.2 ; C37.2 62.84,37.62 v1(62.23,37.62) ; v1(55.32,47.17) 55.47,47.32 U2.63 ; 14.28,31.39 14.25,31.37 v1(13.72,31.37) ; C10.2 30.5,45.54 31.42,45.54 31.42,46.06 31.71,46.36 31.71,47.18 ; v1(71.22,58.9) 71.65,58.9 C44.2 ; v1(59.33,45.54) 59.96,45.54 D21.1 60.01,44.53 C50.1 ; U2.99 43.52,55.69 v1(44.35,56.51) 45.03,56.51 ; D20.1 55.55,34.87 55.55,33.82 C49.1 ; 53.47,33.81 53.47,34.3 53.46,34.3 53.47,34.32 D18.1 ; C46.2 77.98,33.35 77.72,33.09 U16.2 v1(77.72,31.82)
  Top Layer w0.381: R16.2 25.17,42.92 v1(25.15,42.9) 25.15,42.34 C23.2 ; v1(39.12,34.72) 39.27,34.87 D16.1 39.64,33.81 C43.1 ; C40.1 37.57,33.81 D15.1 37.13,34.87 v1(36.98,34.72) ; R43.1 75.11,50.03 Q9.2 75.11,51.76 v1(75.08,51.79) ; R44.1 70.54,50.03 Q10.2 70.54,51.81 v1(70.51,51.84) ; 62.89,35.2 62.41,34.72 v1(62.08,34.72) ; v1(19.93,55.27) 19.93,53.12 U6.1 19.56,52.75 v1(19.2,52.75) 17.63,52.75 16.81,51.94 v1(16.81,50.82) ; C21.2 27.81,39.32 v1(28.14,38.99) ; v1(31.7,47.17) 31.71,47.18
  Top Layer w0.508: v1(28.96,57.22) 28.96,56.64 R7.2 ; v1(33.41,49.38) 34.63,49.38 35.15,49.91 39.2,49.91 39.23,49.94
  Bottom Layer w0.254: v1(86.31,48.99) 86.28,49.02 U12.1 ; U15.2 72.69,54.86 v1(72.69,53.72) ; C51.1 47.16,43.65 v1(46.46,43.65)
  Bottom Layer w0.381: v1(48.88,60.35) 48.88,60.54 CN4.6 ; v1(63.25,31.57) 65.14,31.57 R17.2 65.1,32.29 63.29,32.29 v1(63.25,32.33) ; R14.2 11,32.66 v1(11,33.16) 11,34.1 R13.1 ; CN4.5 56.48,60.35 v1(57.39,60.35)
  vias: v1(0.66,44.52) v1(0.76,61.44) v1(0.76,60.81) v1(0.76,60.17) v1(0.76,59.54) v1(0.76,58.9) v1(1.3,44.52) v1(1.63,62.25) v1(1.93,44.52) v1(2.26,62.25) v1(2.57,44.52) v1(2.9,62.25) v1(3.2,44.52) v1(3.53,62.25) v1(4.17,62.25) v1(8.54,56.36) v1(8.48,46.05) v1(8.48,45.41) v1(8.48,44.73) v1(12.77,35.9) v1(13,56.21) v1(13.21,44.73) v1(13.82,35.89) v1(15.19,35.89) v1(19.89,52.75) v1(20.42,58.29) v1(20.57,52.75) v1(22.71,50.87) v1(23.57,47.17) v1(24.54,47.17) v1(25.5,47.17) v1(28.04,42.69) v1(38.66,51.84) v1(38.71,48.99) v1(40.44,37.67) v1(42.02,54.27) v1(42.37,37.67) v1(45.53,31.53) v1(45.72,37.77) v1(45.82,52.45) v1(45.82,51.81) v1(45.82,51.18) v1(45.82,50.54) v1(45.82,49.91) v1(45.82,49.27) v1(45.82,48.64) v1(45.82,48) v1(45.82,47.36) v1(45.82,46.72) v1(45.82,46.09) v1(45.82,45.45) v1(51.31,37.92) v1(51.41,33.5) v1(52.51,57.75) v1(53.39,51.81) v1(53.39,51.18) v1(53.39,50.54) v1(53.39,49.91) v1(53.39,49.27) v1(53.39,48.64) v1(53.44,33.45) v1(53.95,48) v1(53.95,47.37) v1(53.95,46.73) v1(53.95,46.1) v1(53.95,45.46) v1(53.95,44.83) v1(53.95,44.19) v1(53.95,43.56) v1(53.95,42.92) v1(53.95,42.29) v1(55.49,34.3) v1(55.9,54.32) v1(57.58,34.3) v1(59.23,40.26) v1(67.06,31.82) v1(68.22,37.82) v1(72.39,31.91) v1(74.46,31.91) v1(79.73,31.42) v1(80.01,61.13) v1(80.37,31.42) v1(81,31.42) v1(81.64,31.42) v1(82.85,31.91) v1(84.88,61.13) v1(84.92,31.91) v1(85.55,39.65) v1(86.66,31.42) v1(87.3,31.42) v1(87.94,31.42) v1(88.31,50.86) v1(88.31,44.7) v1(88.41,35.33) v1(88.47,42.74) v1(88.57,31.42) v1(89.21,31.42)
VDDA: length 5.3
  Top Layer w0.254: U2.36 48.02,40.43 v1(48.51,40.92) 48.51,39.78 U2.37
  Bottom Layer w0.635: v1(48.51,40.92) 48.55,40.96 L3.2 48.56,42.05 C51.2
ADC1_IN1: length 29.6
  Top Layer w0.254: v1(42.82,44.07) 42.52,44.07 42.27,43.82 U2.20 40.29,43.82 39.27,42.8 39.27,36.35 38.42,35.5 D15.2
  Top Layer w0.381: R42.2 C40.2 38.43,34.86 D15.2
  Inner2 w0.254: v1(42.82,44.07) 42.82,44.73 41.5,46.05 41.5,52.34 40.33,53.52 38.61,53.52 38.25,53.87 38.25,56.11 H13.3
ADC1_IN2: length 32.1
  Top Layer w0.254: 40.2,43.22 39.63,42.65 39.62,42.65 39.62,36.7 40.2,36.13 40.2,35.17 D16.2 ; 40.2,43.22 40.2,43.22 ; 40.2,43.22 40.3,43.32 U2.21 42.69,43.32 42.77,43.41
  Top Layer w0.381: D16.2 40.5,34.86 C43.2 R45.2
  Inner2 w0.254: v1(42.82,43.42) 42.31,43.42 41.15,44.57 41.15,52.2 40.18,53.16 36.32,53.16 35.76,53.71 H13.1
ADC2_IN11: length 18.6
  Top Layer w0.254: U17.1 43.38,30.81 41.5,30.81 41.22,31.09 41.22,39.22 42.84,40.85 45.27,40.85 45.52,40.59 U2.31
  Top Layer w0.508: U17.2 U17.1
ADC2_IN12: length 37.4
  Top Layer w0.254: R48.2 52.25,32.64 D17.2 52.25,36.01 52.07,36.19 49.67,36.19 47.02,38.84 U2.34 47.04,39.79 47.04,40.56 v1(46.58,41.02)
  Inner2 w0.254: H13.2 37.22,57.24 41.29,57.24 43.99,54.54 43.99,42.44 45.41,41.02 v1(46.58,41.02)
ADC2_IN13: length 7.6
  Top Layer w0.254: U17.6 46.66,36.88 46.33,37.21 44.92,37.21 43.52,38.6 U2.27
  Top Layer w0.508: U17.7 U17.6
ADC3_IN2: length 39.1
  Top Layer w0.254: v1(50.55,40.97) 50.47,40.97 50.02,40.53 U2.40 50.02,37.35 50.11,37.26 56.64,37.26 58.47,35.43 58.47,34.88 D19.2 58.46,32.64 R53.2
  Inner2 w0.254: H13.5 40.84,53.51 41.86,52.49 41.86,46.4 43.63,44.63 43.63,42.14 45.52,40.26 49.84,40.26 v1(50.55,40.97)
ADC3_IN4: length 37.9
  Top Layer w0.254: R52.2 C45.2 54.33,34.86 D18.2 54.32,36.17 53.95,36.55 49.82,36.55 49.02,37.34 U2.38 49.02,40.82 v1(49.27,41.07)
  Inner2 w0.254: v1(49.27,41.07) 47.85,42.49 45.52,42.49 44.45,43.56 44.45,54.68 41.54,57.59 39.41,57.59 H13.4
ADC3_IN6: length 37.8
  Top Layer w0.254: v1(50.04,41.63) 50.04,41.04 49.52,40.53 U2.39 49.52,37.35 49.97,36.9 54.72,36.9 56.4,35.23 D20.2 56.4,32.64 R56.2
  Inner2 w0.254: 48.82,42.84 45.77,42.84 44.96,43.66 44.96,54.79 41.05,58.7 H13.6 ; 48.82,42.84 v1(50.04,41.63) ; 48.82,42.84 48.72,42.95
ADC4_IN3: length 18.2
  Top Layer w0.203: U2.51 55.78,41.32 55.63,41.16 55.63,40.86 56.99,39.49 59.69,39.49 60.66,38.53 64.47,38.53 66.19,40.25 68.85,40.25 68.85,40.25 D22.2 70.51,40.25 R68.2
ADC4_IN12: length 6.9
  Top Layer w0.254: U2.55 56.59,43.3 58.67,43.3 59.28,43.91 60.66,43.91 60.87,44.13 ; 60.87,44.13 C50.2 60.87,45.58 D21.2 ; 60.87,44.13 R61.2
AUXVOLTAGEINPUT: length 12.3
  Top Layer w0.254: U5.2 10.36,41.17 9.6,41.17 9.12,40.69 R3.2 R4.2
  Top Layer w0.508: R4.2 8.36,39.85 v1(7.77,39.85)
  Top Layer w0.762: v1(7.77,41.88) v1(7.77,39.85) v1(7.77,37.82)
  Bottom Layer w0.762: v1(7.77,41.88) v1(7.77,39.85) v1(7.77,37.82)
  vias: v1(5.78,19.68) v1(5.78,11.76) v1(6.41,19.68) v1(6.41,11.76) v1(6.6,6.7) v1(6.6,5.43) v1(6.6,4.16) v1(7.05,19.68) v1(7.05,11.76) v1(7.24,7.34) v1(7.24,6.7) v1(7.24,6.07) v1(7.24,5.43) v1(7.24,4.8) v1(7.24,4.16) v1(7.24,3.53) v1(7.68,19.68) v1(7.68,11.76) v1(7.87,7.34) v1(7.87,6.7) v1(7.87,6.07) v1(7.87,5.43) v1(7.87,4.8) v1(7.87,4.16) v1(7.87,3.53) v1(8.32,19.68) v1(8.32,11.76) v1(8.51,7.34) v1(8.51,6.7) v1(8.51,6.07) v1(8.51,5.43) v1(8.51,4.8) v1(8.51,4.16) v1(8.51,3.53) v1(8.95,19.68) v1(8.95,11.76) v1(9.14,7.34) v1(9.14,6.7) v1(9.14,6.07) v1(9.14,5.43) v1(9.14,4.8) v1(9.14,4.16) v1(9.14,3.53) v1(9.82,9.64) v1(9.82,8.88) v1(9.78,7.34) v1(9.78,6.7) v1(9.78,6.07) v1(9.78,5.43) v1(9.78,4.8) v1(9.78,4.16) v1(9.78,3.53) v1(10.41,7.34) v1(10.41,6.7) v1(10.41,6.07) v1(10.41,5.43) v1(10.41,4.8) v1(10.41,4.16) v1(10.41,3.53)
BUZZER: length 34.2
  Top Layer w0.254: 26.26,60.68 18.59,60.68 17.37,59.46 17.37,57.27 17.07,56.97 16.55,56.97 R37.2 ; 26.26,60.68 28.8,60.68 36.16,53.32 U2.1 ; 26.26,60.68 H5.1
  Top Layer w0.381: Q6.1 15.97,56.4 R37.2
C_CAP+: length 10.5
  Top Layer w0.254: U16.4 77.07,31.16 77.16,31.25 78.7,31.25 82.55,27.4 R20.1
  vias: v1(80.95,25.6) v1(80.95,24.84) v1(80.95,24.08) v1(80.95,23.31) v1(82.25,25.6) v1(82.25,24.84) v1(82.25,24.08) v1(82.25,23.31) v1(83.01,25.6) v1(83.01,24.84) v1(83.01,24.08) v1(83.01,23.31) v1(85.24,18.82) v1(85.24,18.18) v1(85.24,17.55) v1(85.24,16.91) v1(85.24,16.28) v1(85.24,13.18) v1(85.24,12.55) v1(85.24,11.91) v1(85.24,11.28) v1(85.24,10.64)
C_CAP-: length 22.1
  Top Layer w0.254: Q3.8 61.87,27.95 61.87,28.88 61.29,29.46 R47.2 50.42,31.34 ; R60.2 50.12,31.59 50.37,31.34 ; R20.2 76.3,24.51 76.3,27.35 77.72,28.78 U16.5
  vias: v1(61.85,27.62) v1(61.85,26.99) v1(61.85,26.35) v1(62.48,28.26) v1(62.48,27.62) v1(62.48,26.99) v1(62.48,26.35) v1(63.12,27.62) v1(63.12,26.99) v1(63.12,26.35) v1(63.75,28.26) v1(63.75,27.62) v1(63.75,26.99) v1(63.75,26.35) v1(64.39,27.62) v1(64.39,26.99) v1(64.39,26.35) v1(65.02,28.26) v1(65.02,27.62) v1(65.02,26.99) v1(65.02,26.35) v1(65.66,27.62) v1(65.66,26.99) v1(65.66,26.35) v1(75.89,25.65) v1(75.89,24.89) v1(75.89,24.13) v1(75.89,23.36) v1(76.66,25.65) v1(76.66,24.89) v1(76.66,24.13) v1(76.66,23.36) v1(77.95,25.65) v1(77.95,24.89) v1(77.95,24.13) v1(77.95,23.36)
C_LEFT+: length 9.2
  Top Layer w0.254: U14.4 10.36,30.66 10.36,29.59 14.12,25.83 14.12,23.07 FH1.2
  vias: v1(15.55,23.99) v1(15.55,23.35) v1(15.55,22.72) v1(15.55,22.08) v1(16.19,23.99) v1(16.19,23.35) v1(16.19,22.72) v1(16.19,22.08) v1(24.26,22.16) v1(24.26,21.61) v1(24.89,22.16) v1(24.9,21.61) v1(25.91,21.61)
C_LEFT-: length 24.4
  Top Layer w0.254: 13.06,27.51 11,29.56 U14.5 ; 13.06,27.51 13.06,31.39 ; 13.06,27.51 14.07,26.49 23.88,26.49 ; v1(41.76,32.03) 41.78,32 R58.2
  Bottom Layer w0.254: v1(42.49,27.64) 41.76,28.38 v1(41.76,32.03)
  vias: v1(22.73,26.97) v1(22.73,26.21) v1(22.73,24.92) v1(23.5,26.97) v1(23.5,26.21) v1(23.5,24.92) v1(24.26,26.97) v1(24.26,26.21) v1(24.26,24.92) v1(25.02,26.97) v1(25.02,26.21) v1(25.02,24.92) v1(38.68,27.64) v1(38.68,27.01) v1(38.68,26.37) v1(39.32,28.28) v1(39.32,27.64) v1(39.32,27.01) v1(39.32,26.37) v1(39.95,27.64) v1(39.95,27.01) v1(39.95,26.37) v1(40.59,28.28) v1(40.59,27.64) v1(40.59,27.01) v1(40.59,26.37) v1(41.22,27.64) v1(41.22,27.01) v1(41.22,26.37) v1(41.86,28.28) v1(41.86,27.64) v1(41.86,27.01) v1(41.86,26.37) v1(42.49,27.01) v1(42.49,26.37)
C_SYS-: length 24.4
  Top Layer w0.254: v1(19.46,29.79) U13.5
  Inner2 w0.381: v1(19.46,29.79) 19.46,25.07 27.08,17.45 27.08,10.83 v1(28.09,9.82)
  vias: v1(11.82,9.67) v1(11.82,8.9) v1(12.08,6.07) v1(12.08,4.8) v1(12.08,3.53) v1(16.54,6.56) v1(16.54,5.79) v1(17.3,6.56) v1(17.3,5.79) v1(28.09,9.05) v1(28.85,9.82) v1(28.85,9.05) v1(29.62,9.82) v1(29.62,9.05) v1(29.64,4.11) v1(30.38,9.82) v1(30.38,9.05) v1(30.4,4.87) v1(30.4,4.11)
CAN1H: length 14.6
  Top Layer w0.381: v1(81.48,55.14) 81.48,55.89 R49.2 81.8,56.21 CN1.2
  Bottom Layer w0.381: U15.7 72.72,59.59 73.04,59.27 75.15,59.27 75.85,59.97 76.66,59.97 v1(81.48,55.14)
CAN1L: length 17.2
  Top Layer w0.381: v1(83.06,55.14) 83.06,55.95 R49.1 83.05,57.63
  Bottom Layer w0.381: U15.6 72.08,61 72.08,61.1 72.45,61.47 75.95,61.47 82.29,55.14 v1(83.06,55.14)
CAN1R: length 17.6
  Top Layer w0.254: U2.72 57.64,51.82 57.78,51.96 58.19,51.96 v1(58.22,51.99)
  Inner2 w0.254: v1(58.22,51.99) 58.93,51.99 62.59,55.66 66.46,55.66 68.09,54.02 v1(70.81,54.02)
  Bottom Layer w0.254: v1(70.81,54.02) 70.81,54.26 U15.4
CAN1T: length 21.9
  Top Layer w0.254: U2.73 57.58,52.32 57.81,52.55 v1(58.47,52.55)
  Inner2 w0.254: v1(58.47,52.55) 58.98,52.55 64.63,58.2 71.87,58.2 v1(74.02,56.06)
  Bottom Layer w0.254: v1(74.02,56.06) 73.99,56.03 U15.1
LED_0: length 42.1
  Top Layer w0.254: Q7.1 9.96,46.22 v1(9.96,47.17) ; U2.2 41.46,52.8 36.17,52.8 29.57,59.41 H5.2
  Top Layer w0.381: Q7.1 9.97,45.3 R38.2
  Inner2 w0.254: H5.2 27.53,59.05 26.21,57.73 20.52,57.73 v1(9.96,47.17)
LED_1: length 47.1
  Top Layer w0.254: v1(5.08,47.17) 5.08,47.16 Q8.1 ; v1(40.34,52.3) 41.45,52.3 U2.3
  Top Layer w0.381: Q8.1 5.08,45.3 5.6,44.79
  Inner2 w0.254: v1(40.34,52.3) 39.83,52.8 36.17,52.8 30.02,58.95 28.7,58.95 27.13,57.38 20.88,57.38 10.16,46.66 9.19,46.66 8.69,47.17 v1(5.08,47.17)
LED_B_0: length 20.5
  Top Layer w0.254: R43.2 70.39,46.17 59.1,46.17 58.22,45.29 56.6,45.29 U2.59
  Top Layer w0.381: Q9.1 73.21,50.03 R43.2
LED_B_1: length 15.7
  Top Layer w0.254: U2.60 58.25,45.82 58.95,46.53 66.18,46.53 R44.2
  Top Layer w0.381: Q10.1 68.64,50.03 R44.2
LEFT_HG: length 11.6
  Top Layer w0.254: R63.1 35.36,23.7 34.84,24.21 D8.1
  Inner2 w0.254: v1(33.88,24.2) 31.35,26.74 v1(31.35,32.2)
LEFT_LG: length 27.8
  Top Layer w0.254: D12.1 v1(36.22,10.64) 36.5,10.92 36.5,12.22
  Inner2 w0.254: v1(25.8,29.66) 25.8,28.89 32.61,22.07 32.61,11.4 33.38,10.64 v1(36.22,10.64)
LEFT_M: length 28.8
  Top Layer w0.254: C29.1 C32.1 26.67,34.47 27.28,34.47 28.3,33.45 31.35,33.45 31.37,33.47 ; v1(35.2,20.8) v1(35.2,20.17) v1(35.2,19.53) v1(35.2,18.9) Q4.8 ; v1(36.47,20.8) v1(36.47,20.17) 36.47,19.72 Q4.8 ; Q4.8 33.93,19.72 v1(33.93,20.17) v1(33.93,20.8)
  Top Layer w0.381: v1(36.58,23.8) R24.1
  Inner2 w0.254: v1(31.34,33.5) 31.34,32.99 31.86,32.48 31.86,30.35 31.85,30.35 31.85,27 35.05,23.8 v1(36.58,23.8)
  vias: v1(33.3,20.17) v1(33.3,19.53) v1(33.3,18.9) v1(33.93,19.53) v1(33.93,18.9) v1(34.57,20.17) v1(34.57,19.53) v1(34.57,18.9) v1(35.84,20.17) v1(35.84,19.53) v1(35.84,18.9) v1(36.47,19.53) v1(36.47,18.9) v1(37.11,20.17) v1(37.11,19.53) v1(37.11,18.9) v1(38.67,21.52) v1(39.31,22.43) v1(39.97,21.52) v1(40.58,22.43) v1(41.24,21.52) v1(45.44,27.02) v1(45.44,26.39) v1(45.44,25.75) v1(45.44,25.12) v1(45.44,24.48) v1(45.44,23.85) v1(45.44,23.21) v1(46.07,27.02) v1(46.07,26.39) v1(46.07,25.75) v1(46.07,25.12) v1(46.07,24.48) v1(46.07,23.85) v1(46.07,23.21) v1(46.71,27.02) v1(46.71,26.39) v1(46.71,25.75) v1(46.71,25.12) v1(46.71,24.48) v1(46.71,23.85) v1(46.71,23.21) v1(47.34,27.02) v1(47.34,26.39) v1(47.34,25.75) v1(47.34,25.12) v1(47.34,24.48) v1(47.34,23.85) v1(47.34,23.21) v1(47.27,18.74) v1(47.27,18.11) v1(47.27,17.47) v1(47.27,16.84) v1(47.9,18.74) v1(47.9,18.11) v1(47.9,17.47) v1(47.9,16.84) v1(47.98,27.02) v1(47.98,26.39) v1(47.98,25.75) v1(47.98,25.12) v1(47.98,24.48) v1(47.98,23.85) v1(47.98,23.21) v1(48.54,18.74) v1(48.54,18.11) v1(48.54,17.47) v1(48.54,16.84) v1(48.61,27.02) v1(48.61,26.39) v1(48.61,25.75) v1(48.61,25.12) v1(48.61,24.48) v1(48.61,23.85) v1(48.62,23.19) v1(49.17,18.74) v1(49.17,18.11) v1(49.17,17.47) v1(49.17,16.84)
PA8: length 21.8
  Top Layer w0.203: 62.66,60.24 C53.2 62.64,59.19 62.64,58.65 62.98,58.3 R69.2 ; 62.66,60.24 D23.2 ; 62.66,60.24 65.36,60.24 65.99,59.61
  Top Layer w0.254: U2.69 55.38,50.32 v1(55.37,50.32)
  Inner2 w0.254: 65.99,59.61 65.54,59.61 58.99,53.06 58.12,53.06 v1(55.37,50.32)
PC6: length 9.9
  Top Layer w0.254: U2.65 61.55,48.32 62.47,49.24 65.77,49.24 H6.5
PC7: length 10.7
  Top Layer w0.254: U2.66 59.46,48.82 62.28,51.64 64.62,51.64 64.97,51.99 65.99,51.99
PC8: length 12.9
  Top Layer w0.254: U2.67 59.46,49.32 59.74,49.6 59.74,51.84 62.38,54.48 65.94,54.48 H6.3
PC9: length 13.6
  Top Layer w0.254: U2.68 56.64,49.89 59.11,49.89 59.33,50.11 59.33,52.18 64.23,57.07 H6.2
PIO_0: length 11
  Top Layer w0.254: v1(57.71,42.14) 57.53,42.32 U2.53
  Inner2 w0.254: H7.3 60.05,47.83 58.27,46.05 58.27,42.29 58.12,42.14 v1(57.71,42.14)
PIO_1: length 13.7
  Top Layer w0.254: U2.54 56.59,42.8 v1(57.76,42.8)
  Inner2 w0.254: H7.1 62.58,52.91 61.62,51.94 61.62,50.01 57.76,46.15 v1(57.76,42.8)
REF3V3: length 33.2
  Top Layer w0.254: C21.1 28.69,39.76 U7.5 28.69,41.72 29.21,42.24 29.21,42.59 ; C46.1 77.11,35.43 74.17,38.38 v1(74.17,40.87) ; 29.21,42.59 30.17,42.59 L2.2 ; 29.21,42.59 29.21,43.89 28.83,44.27 R11.1 ; U13.3 18.81,33.75 C39.1
  Top Layer w0.381: 42.65,36.73 42.65,36.52 ; 42.65,36.52 C48.1 ; 42.65,36.52 43.56,35.61 U17.8 44.12,37.28 v1(43.74,37.67) ; C39.1 18.77,33.93 v1(16.1,36.6) ; C46.1 77.07,33.72 U16.3 ; v1(10.36,36.6) 10.36,32.58 U14.3 ; U7.5 28.71,40.92 v1(29.92,40.92)
RESET: length 14.5
  Top Layer w0.254: U2.14 40.3,46.82 39.78,46.3 v1(39.32,46.3) ; C9.2 R2.1 36.55,44.85 36.63,44.78 SW1.1
  Inner2 w0.203: v1(37.26,37.7) 37.26,44.7 v1(37.34,44.78)
  Inner2 w0.254: v1(37.34,44.78) 38.86,46.3 v1(39.32,46.3)
RIGHT_HG: length 18.5
  Top Layer w0.254: 69.11,23.58 69.13,23.59 70,23.59 70.56,24.15 v1(70.56,24.97)
  Inner2 w0.254: v1(71,35.81) 68.91,35.81 65.99,32.89 65.99,29.54 v1(70.56,24.97)
RIGHT_LG: length 27
  Top Layer w0.254: v1(72.01,12.42) D13.1 70.16,12.42 69.7,11.96 69.7,11.02 R65.2
  Inner2 w0.254: v1(72.01,12.42) 72.01,22.81 65.45,29.37 v1(65.45,33.27)
RIGHT_M: length 25.7
  Top Layer w0.254: v1(67.87,24.21) R25.1 66.18,23.57 66.17,23.56 65.47,23.56 64.39,22.48 Q3.3 ; v1(71,37.08) 72.72,37.08 C38.1 C35.1
  Inner2 w0.254: v1(71,37.08) 70.97,37.06 68.38,37.06 64.95,33.63 64.95,29.21 67.87,26.29 v1(67.87,24.21)
  vias: v1(55.19,18.74) v1(55.19,18.11) v1(55.19,17.47) v1(55.19,16.84) v1(55.81,27.14) v1(55.81,26.51) v1(55.81,25.87) v1(55.81,25.24) v1(55.81,24.6) v1(55.81,23.97) v1(55.81,23.33) v1(55.83,18.74) v1(55.83,18.11) v1(55.83,17.47) v1(55.83,16.84) v1(56.44,27.14) v1(56.44,26.51) v1(56.44,25.87) v1(56.44,25.24) v1(56.44,24.6) v1(56.44,23.97) v1(56.44,23.33) v1(56.46,18.74) v1(56.46,18.11) v1(56.46,17.47) v1(56.46,16.84) v1(57.08,27.14) v1(57.08,26.51) v1(57.08,25.87) v1(57.08,25.24) v1(57.08,24.6) v1(57.08,23.97) v1(57.08,23.33) v1(57.1,18.74) v1(57.1,18.11) v1(57.1,17.47) v1(57.1,16.84) v1(57.71,27.14) v1(57.71,26.51) v1(57.71,25.87) v1(57.71,25.24) v1(57.71,24.6) v1(57.71,23.97) v1(57.71,23.33) v1(58.35,27.14) v1(58.35,26.51) v1(58.35,25.87) v1(58.35,25.24) v1(58.35,24.6) v1(58.35,23.97) v1(58.35,23.33) v1(58.98,27.14) v1(58.98,26.51) v1(58.98,25.87) v1(58.98,25.24) v1(58.98,24.6) v1(58.98,23.97) v1(58.98,23.33) v1(61.88,23.42) v1(61.88,21.53) v1(62.49,22.47) v1(63.15,23.4) v1(63.15,21.51) v1(63.76,22.45) v1(64.42,23.4) v1(64.42,21.51) v1(67.3,20.21) v1(67.3,19.57) v1(67.3,18.94) v1(67.94,20.84) v1(67.94,20.21) v1(67.94,19.57) v1(67.94,18.94) v1(68.57,20.21) v1(68.57,19.57) v1(68.57,18.94) v1(69.21,20.84) v1(69.21,20.21) v1(69.21,19.57) v1(69.21,18.94) v1(69.84,20.21) v1(69.84,19.57) v1(69.84,18.94) v1(70.48,20.84) v1(70.48,20.21) v1(70.48,19.57) v1(70.48,18.94) v1(71.11,20.21) v1(71.11,19.57) v1(71.11,18.94)
SWCLK: length 3.2
  Top Layer w0.254: U2.77 54.51,54.88 54.51,56.11 53.76,56.85 CN2.2
SWDIO: length 2.9
  Top Layer w0.254: CN2.1 55.02,57.74 U2.76
TIM1_CH1: length 36.7
  Top Layer w0.203: v1(22.45,33.55) 22.45,34.19 24.87,36.62 28.97,36.62 31.69,39.34 34,39.34 38.35,43.7 38.35,44.37 40.3,46.32 U2.15
  Top Layer w0.254: v1(22.45,33.55) 23.17,32.84 23.27,32.84
  Inner2 w0.254: H8.2 14.83,28.62 17.57,31.36 17.57,32.43 17.98,32.84 21.74,32.84 v1(22.45,33.55)
TIM1_CH1N: length 39.4
  Top Layer w0.203: 33.89,39.7 33.93,39.7 ; 33.89,39.7 31.55,39.7 28.82,36.97 24.73,36.97 21.84,34.09 v1(21.84,31.11) ; 33.89,39.7 38.05,43.86 38.05,46.61 40.34,48.89 40.34,49.94 40.71,50.32 U2.7
  Top Layer w0.254: v1(21.84,31.11) 22.5,30.45 23.27,30.45
  Inner2 w0.254: H8.1 17.37,29.4 18.43,30.45 21.18,30.45 v1(21.84,31.11)
TIM1_CH4: length 28.9
  Top Layer w0.203: 52.85,38.71 59.45,38.71 61.21,36.95 v1(61.21,34.57) ; 52.85,38.71 52.89,38.68 ; 52.85,38.71 52.52,39.05 U2.45
  Top Layer w0.254: v1(61.21,34.57) 61.77,34.01 62.89,34.01
  Inner2 w0.254: H11.1 68.68,39.24 63.45,34.01 61.77,34.01 v1(61.21,34.57)
TIM1_CH4N: length 23.2
  Top Layer w0.203: v1(62.31,36.4) 59.51,39.19 56.86,39.19 54.71,41.35 53.46,41.35 53.02,40.9 U2.46
  Top Layer w0.254: 62.89,36.4 v1(62.31,36.4)
  Inner2 w0.254: v1(62.31,36.4) 64.26,36.4 66.14,38.28 H11.2
USART1_R: length 38.4
  Top Layer w0.254: U2.71 57.54,51.32 57.61,51.38 v1(58.01,51.38)
  Inner2 w0.254: v1(84.99,37.21) 85.49,37.71 85.49,38.64 71.01,53.12 65.52,53.12 64.25,54.39 61.83,54.39 58.82,51.38 v1(58.01,51.38)
USART1_T: length 37.3
  Top Layer w0.254: U2.70 57.75,50.82 v1(57.76,50.82)
  Inner2 w0.254: v1(84.99,38.43) 72.59,50.82 65.19,50.82 64.52,51.49 64.52,53.43 63.91,54.03 61.98,54.03 58.76,50.82 v1(57.76,50.82)
USART2_R: length 6.8
  Top Layer w0.254: v1(49.02,56.51) U2.88
  Bottom Layer w0.254: CN4.2 51.24,58.2 50.5,58.95 49.38,58.95 49.02,58.6 v1(49.02,56.51)
USART2_T: length 3.1
  Top Layer w0.254: v1(49.99,56.46) 49.52,56 U2.87
  Bottom Layer w0.254: v1(49.99,56.46) 49.99,56.47 CN4.1
USART3_R: length 42.4
  Top Layer w0.254: U2.80 53.02,56.02 v1(52.93,56.11) ; v1(83.46,49.05) 84.8,49.05 U11.3
  Inner2 w0.254: v1(52.93,56.11) 53.09,56.26 53.09,56.32 53.38,56.61 60.39,56.61 64.88,61.1 71.51,61.1 83.46,49.15
  Bottom Layer w0.254: U12.2 84.18,47.78 83.46,48.49 v1(83.46,49.05)
USART3_T: length 42.1
  Top Layer w0.254: v1(53.59,56.11) 53.52,56.03 U2.79 ; v1(83.46,47.78) U11.2
  Inner2 w0.254: 83.36,47.93 70.55,60.74 65.02,60.74 60.39,56.11 v1(53.59,56.11)
  Bottom Layer w0.254: v1(83.46,47.78) 83.46,46.71 83.65,46.53 U12.3
$1N1583: length 2.1
  Top Layer w0.254: C11.1 18.26,41.45 18.01,41.19 U5.7
$1N2384: length 1.7
  Top Layer w0.254: U5.4 8.79,38.65 R4.1
$1N2800: length 4
  Top Layer w0.508: D2.1 19.66,39.78 C17.2 17.8,39.78 17.66,39.92 U5.6
$1N3273: length 4
  Top Layer w0.508: U5.5 16.51,38.53 R6.2 R5.2 C18.1
$1N3553: length 4.9
  Top Layer w0.254: 8.74,41.55 9.43,41.55 9.65,41.77 11.13,41.77 11.47,41.43 11.47,40.95 10.44,39.92 U5.3
$1N4814: length 3.9
  Top Layer w0.254: R11.2 27.53,44.25 27.53,43.86 27.39,43.72 U7.3 27.37,43.15 26.82,43.15 26.47,43.51 R16.1 C23.1
$1N6924: length 2.1
  Top Layer w0.508: LED6.1 27.24,56.27 27.58,56.61 R7.1
$1N7417: length 1.8
  Top Layer w0.254: U2.95 45.54,54.89 45.54,55.83 45.92,56.21 45.92,56.49 R1.2
$1N13350: length 10.9
  Top Layer w0.254: U2.12 41.46,47.83 v1(40.44,47.83) ; 33.41,47.18 32.72,46.49 32.72,45.98 C8.2
  Inner2 w0.254: v1(40.44,47.83) 40.44,47.47 39.78,46.81 38.96,46.81 38.61,47.17 33.43,47.17 v1(33.43,47.17)
$1N13370: length 14.3
  Top Layer w0.254: v1(39.47,47.32) U2.13
  Top Layer w0.508: X1.1 v1(31.7,49.4) 31.04,49.4 30.65,49.01 30.65,47.32 30.12,46.8 30.12,46.79
  Inner2 w0.254: v1(31.7,49.4) 33.42,47.67 39.12,47.67 v1(39.47,47.32)
$2N4548: length 3.1
  Top Layer w0.254: U10.5 64.19,37.08 63.75,37.52 ; 63.75,37.52 63.75,37.56 C37.1 ; 63.75,37.52 R33.2
$2N4948: length 3.1
  Top Layer w0.254: R30.2 C30.1 24.69,32.2 U9.6
$2N4950: length 3.1
  Top Layer w0.254: U9.5 24.66,33.47 24.13,34.01 ; 24.13,34.01 R31.2 ; 24.13,34.01 C31.1
$2N5889: length 4
  Top Layer w0.254: U10.2 71.65,34.54 72.75,35.63 C38.2 ; 72.8,36.19 72.85,36.24 C35.2
$2N5937: length 8.9
  Top Layer w0.254: 31.37,30.93 30.25,30.93 27.08,34.11 26.01,34.11 25.42,34.7 C32.2 C29.2
$2N20281: length 3.1
  Top Layer w0.254: U10.6 64.36,35.81 C36.1 R32.2
$2N20527: length 11.7
  Top Layer w0.254: v1(37.39,21.92) 36.6,21.92 R24.2 36.55,21.97 35.33,21.97 ; 35.33,21.97 34.65,21.97 34.54,21.86 D8.2 ; 35.33,21.97 R63.2 ; v1(42.49,21.53) Q2.4
  Inner2 w0.254: v1(42.49,21.53) 42.49,22.45 41.71,23.24 38.25,23.24 37.39,22.38 v1(37.39,21.92)
$2N20631: length 4.5
  Top Layer w0.254: D12.2 37.44,10.64 37.44,11.35 37.36,11.43 R62.2 R28.2 37.34,13.46 37.34,13.99 37.11,14.22 Q4.4
$2N20845: length 5
  Top Layer w0.254: Q3.4 66.59,22.47 66.8,22.68 67.84,22.68 R25.2 69.1,22.7 R64.1 70.47,22.71 D9.2
$2N21567: length 3.2
  Top Layer w0.254: 16.36,2.48 U8.1 ; 16.36,2.48 17.58,2.48 C26.2 ; 16.36,2.48 16.36,1.29 16.22,1.15 R21.1
$2N24690: length 2.1
  Top Layer w0.254: R21.2 14.75,1.14 14.12,1.14 13.95,1.32 U8.6
$2N24699: length 10.8
  Top Layer w0.254: v1(14.68,3.43) 13.96,3.43 U8.5
  Inner2 w0.254: v1(14.68,3.43) 13.56,2.31 11.18,2.31 10.92,2.56 10.92,6.98 11.28,7.34 v1(12.09,7.34)
$2N25292: length 7.1
  Top Layer w0.254: Q5.4 71.11,14.09 70.51,13.49 69.14,13.49 68.78,13.13 68.78,12.42 D13.2 68.78,11.71 68.83,11.66 68.83,11.02 R65.1 R29.2
$2N31679: length 4.3
  Top Layer w0.203: R71.2 19.33,4.13 19.31,4.15 16.58,4.15 U8.3
$3N1263: length 1.6
  Top Layer w0.381: R35.1 10.54,48.58 Q7.3
$3N1304: length 1.6
  Top Layer w0.381: 5.6,49.66 5.6,48.63 Q8.3
$3N1497: length 1.8
  Top Layer w0.381: LED2.1 11.84,50.09 R35.2
$3N1507: length 1.8
  Top Layer w0.381: LED3.1 6.83,50.03 R36.2
$3N1591: length 3.5
  Top Layer w0.508: LED4.1 76.36,56.15 R40.2
$3N1597: length 1.6
  Top Layer w0.381: R40.1 73.73,53.35 Q9.3
$3N1755: length 2.1
  Top Layer w0.381: LED5.1 70.82,55.18 R41.2
$3N1757: length 1.6
  Top Layer w0.381: R41.1 69.16,53.35 Q10.3
$3N5586: length 4.3
  Top Layer w0.381: D14.2 11.77,57.86 R34.2
  Top Layer w0.635: R34.2 10.77,58.86 BUZZER1.2
$3N5630: length 1.6
  Top Layer w0.381: Q6.3 13.13,58 R34.1
$3N7028: length 25.4
  Top Layer w0.254: v1(57.61,32.09) R53.1
  Top Layer w0.381: v1(78.38,30.05) 78.37,30.06 U16.6
  Bottom Layer w0.254: v1(78.38,30.05) 78.38,30.76 78.23,30.91 62.08,30.91 61.77,31.21 61.77,33.14 61.52,33.4 59.49,33.4 58.18,32.09 v1(57.61,32.09)
$3N7040: length 13.1
  Top Layer w0.381: v1(61.26,32.84) 61.29,32.81 R47.1 R46.2
  Top Layer w0.508: R48.1 v1(51.4,32.12) 51.36,32.08
  Bottom Layer w0.254: 51.41,32.08 51.91,31.57 58.27,31.57 59.54,32.84 v1(61.26,32.84)
$3N7048: length 41
  Top Layer w0.254: v1(15.29,32.84) R50.1 R51.2
  Top Layer w0.508: v1(53.44,32.08) 53.47,32.1 53.47,32.64
  Bottom Layer w0.254: v1(53.44,32.08) 52.52,33 15.45,33 v1(15.29,32.84)
$3N7064: length 46.5
  Top Layer w0.254: R54.2 R55.1 v1(13.06,32.84)
  Top Layer w0.508: R56.1 55.54,32.09 v1(55.52,32.08)
  Bottom Layer w0.254: v1(13.06,32.84) 14.58,32.84 15.8,34.06 54.21,34.06 55.52,32.74 v1(55.52,32.08)
